# EAGLE design v2 demo (EAGLE 7.6.0)
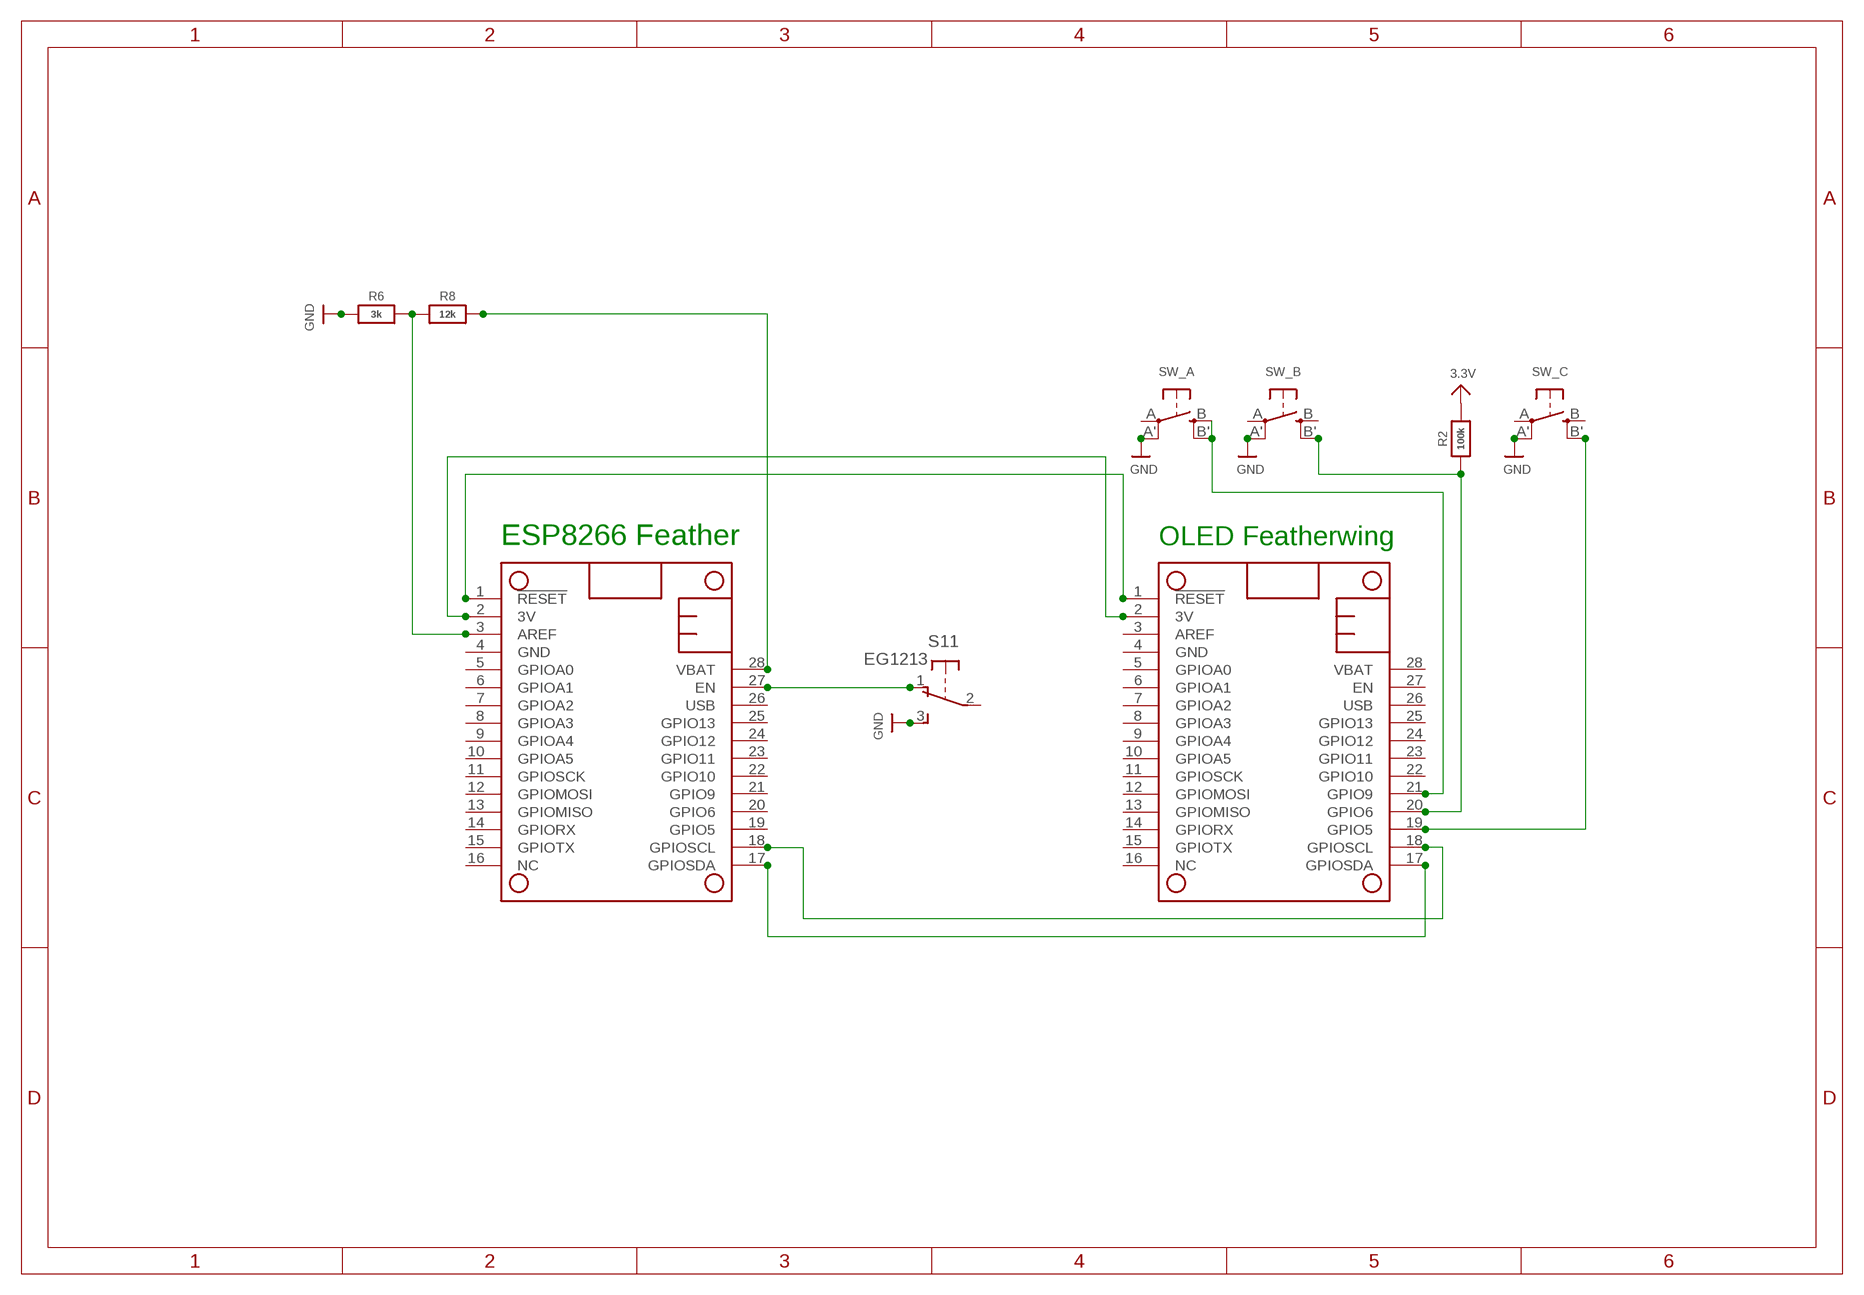
[diagram p0: schematic, sheet 1]

## Parts
MS1  FEATHERWING  [FEATHERWING]
MS2  FEATHERWING_NODIM  [FEATHERWING_DIM]
R2  100k  MICROBUILDER_RESISTOR0603MINI  [MICROBUILDER_0603-MINI]
R6  3k  MICROBUILDER_RESISTOR0603MINI  [MICROBUILDER_0603-MINI]
R8  12k  MICROBUILDER_RESISTOR0603MINI  [MICROBUILDER_0603-MINI]
S1  EG1213  [EG1213]
SW_A  MICROBUILDER_SWITCH_TACT_SMTKMT0  [MICROBUILDER_BTN_KMT0]
SW_B  MICROBUILDER_SWITCH_TACT_SMTKMT0  [MICROBUILDER_BTN_KMT0]
SW_C  MICROBUILDER_SWITCH_TACT_SMTKMT0  [MICROBUILDER_BTN_KMT0]

## Nets
3.3V: R2.2
3V: MS1.2(3V) MS2.2(3V)
GND: R6.1 S1.3(1:S) SW_A.A'(P1) SW_B.A'(P1) SW_C.A'(P1)
N$26: MS2.21(GPIO9) SW_A.B'(S1) SW_A.B(S)
N$27: MS2.20(GPIO6) R2.1 SW_B.B'(S1)
N$28: MS1.18(GPIOSCL) MS2.18(GPIOSCL)
N$29: MS1.17(GPIOSDA) MS2.17(GPIOSDA)
N$30: MS1.1(!RESET) MS2.1(!RESET)
N$31: MS2.19(GPIO5) SW_C.B'(S1)
N$32: MS1.3(AREF) R6.2 R8.1
N$34: MS1.27(EN) S1.1(1:O)
VBAT: MS1.28(VBAT) R8.2
Unconnected: MS1.5(GPIOA0) MS1.6(GPIOA1) MS1.7(GPIOA2) MS1.8(GPIOA3) MS1.9(GPIOA4) MS1.10(GPIOA5) MS1.11(GPIOSCK) MS1.12(GPIOMOSI) MS1.13(GPIOMISO) MS1.14(GPIORX) MS1.15(GPIOTX) MS1.16(NC) MS1.19(GPIO5) MS1.20(GPIO6) MS1.21(GPIO9) MS1.22(GPIO10) MS1.23(GPIO11) MS1.24(GPIO12) MS1.25(GPIO13) MS1.26(USB) MS2.3(AREF) MS2.5(GPIOA0) MS2.6(GPIOA1) MS2.7(GPIOA2) MS2.8(GPIOA3) MS2.9(GPIOA4) MS2.10(GPIOA5) MS2.11(GPIOSCK) MS2.12(GPIOMOSI) MS2.13(GPIOMISO) MS2.14(GPIORX) MS2.15(GPIOTX) MS2.16(NC) MS2.22(GPIO10) MS2.23(GPIO11) MS2.24(GPIO12) MS2.25(GPIO13) MS2.26(USB) MS2.27(EN) MS2.28(VBAT) S1.2(1:P) S1.MT1(MT) S1.MT2(MT) SW_A.A(P) SW_B.A(P) SW_B.B(S) SW_C.A(P) SW_C.B(S)

## Notes on the sheet
- ESP8266 Feather | OLED Featherwing

## Power pins joined to a net without a drawn wire
GND: MS1.4(GND) MS2.4(GND)

## Library data of the parts
MS1 MS2 = adafruit:FEATHERWING
R2 R6 R8 = adafruit oled featherwing:MICROBUILDER_RESISTOR: Resistors For new designs, use the packages preceded by an '_' character since they are more reliable: The following footprints should be used on most boards: _0402 - Standard footprint for regular board layouts _0603 - Standard footprint for regular board layouts _0805 - Standard footprint for regular board layouts _1206 - Standard footprint for regular board layouts For extremely tight-pitch boards where space is at a premium, the following 'micro-pitch' footprints can be used (smaller pads, no silkscreen outline, etc.): _0402MP - Micro-pitch footprint for very dense/compact boards _0603MP - Micro-pitch footprint for very dense/compact boards _0805MP - Micro-pitch footprint for very dense/compact boards _1206MP - Micro-pitch footprint for very dense/compact boards
S1 = adafruit:EG1213: E-Switch right-angle slide SPDT Part #EG1213 http://www.ladyada.net/library/eagle
SW_A SW_B SW_C = adafruit oled featherwing:MICROBUILDER_SWITCH_TACT_SMT: SMT Tact Switches 6x6mm - Digikey: P12940SCT-ND KMR2 (4.6x2.8mm) - Digikey: 401-1426-1-ND EVQ-PQHB55 - Light Touch, 160GF (4.5x4.5mm) - Digikey: P8090SCT-ND KMT0 - KMT021 NGJ LHS (etc.) IP68/Waterproof - Digikey: CKN10289CT-ND

## Board
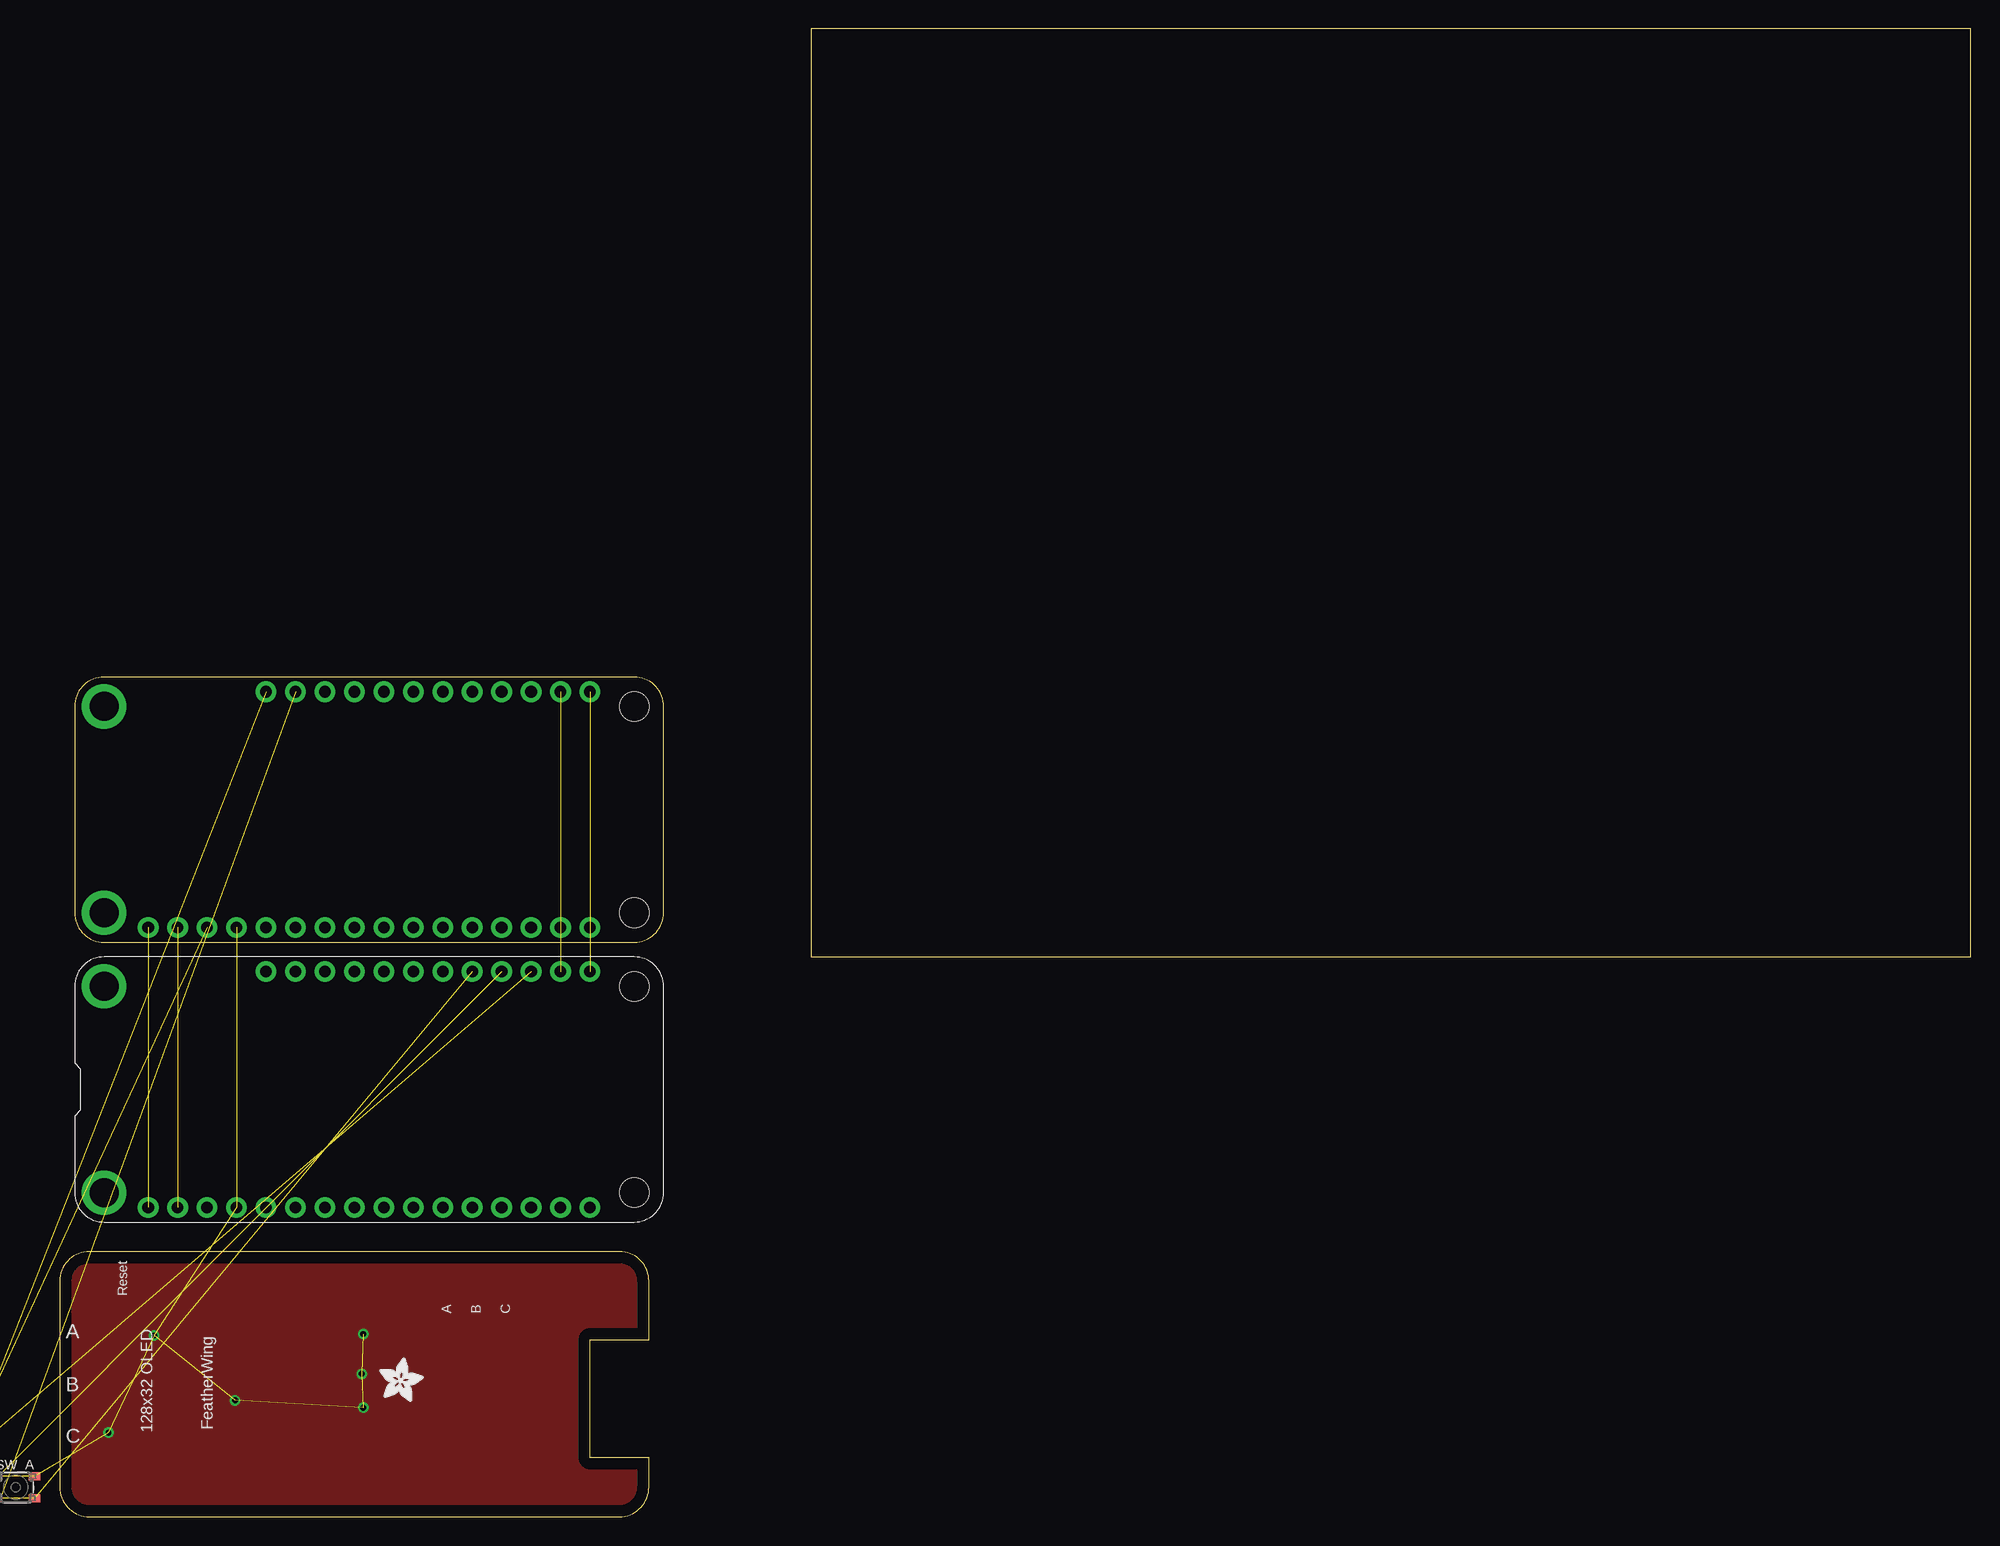
[diagram p1: board, top side]
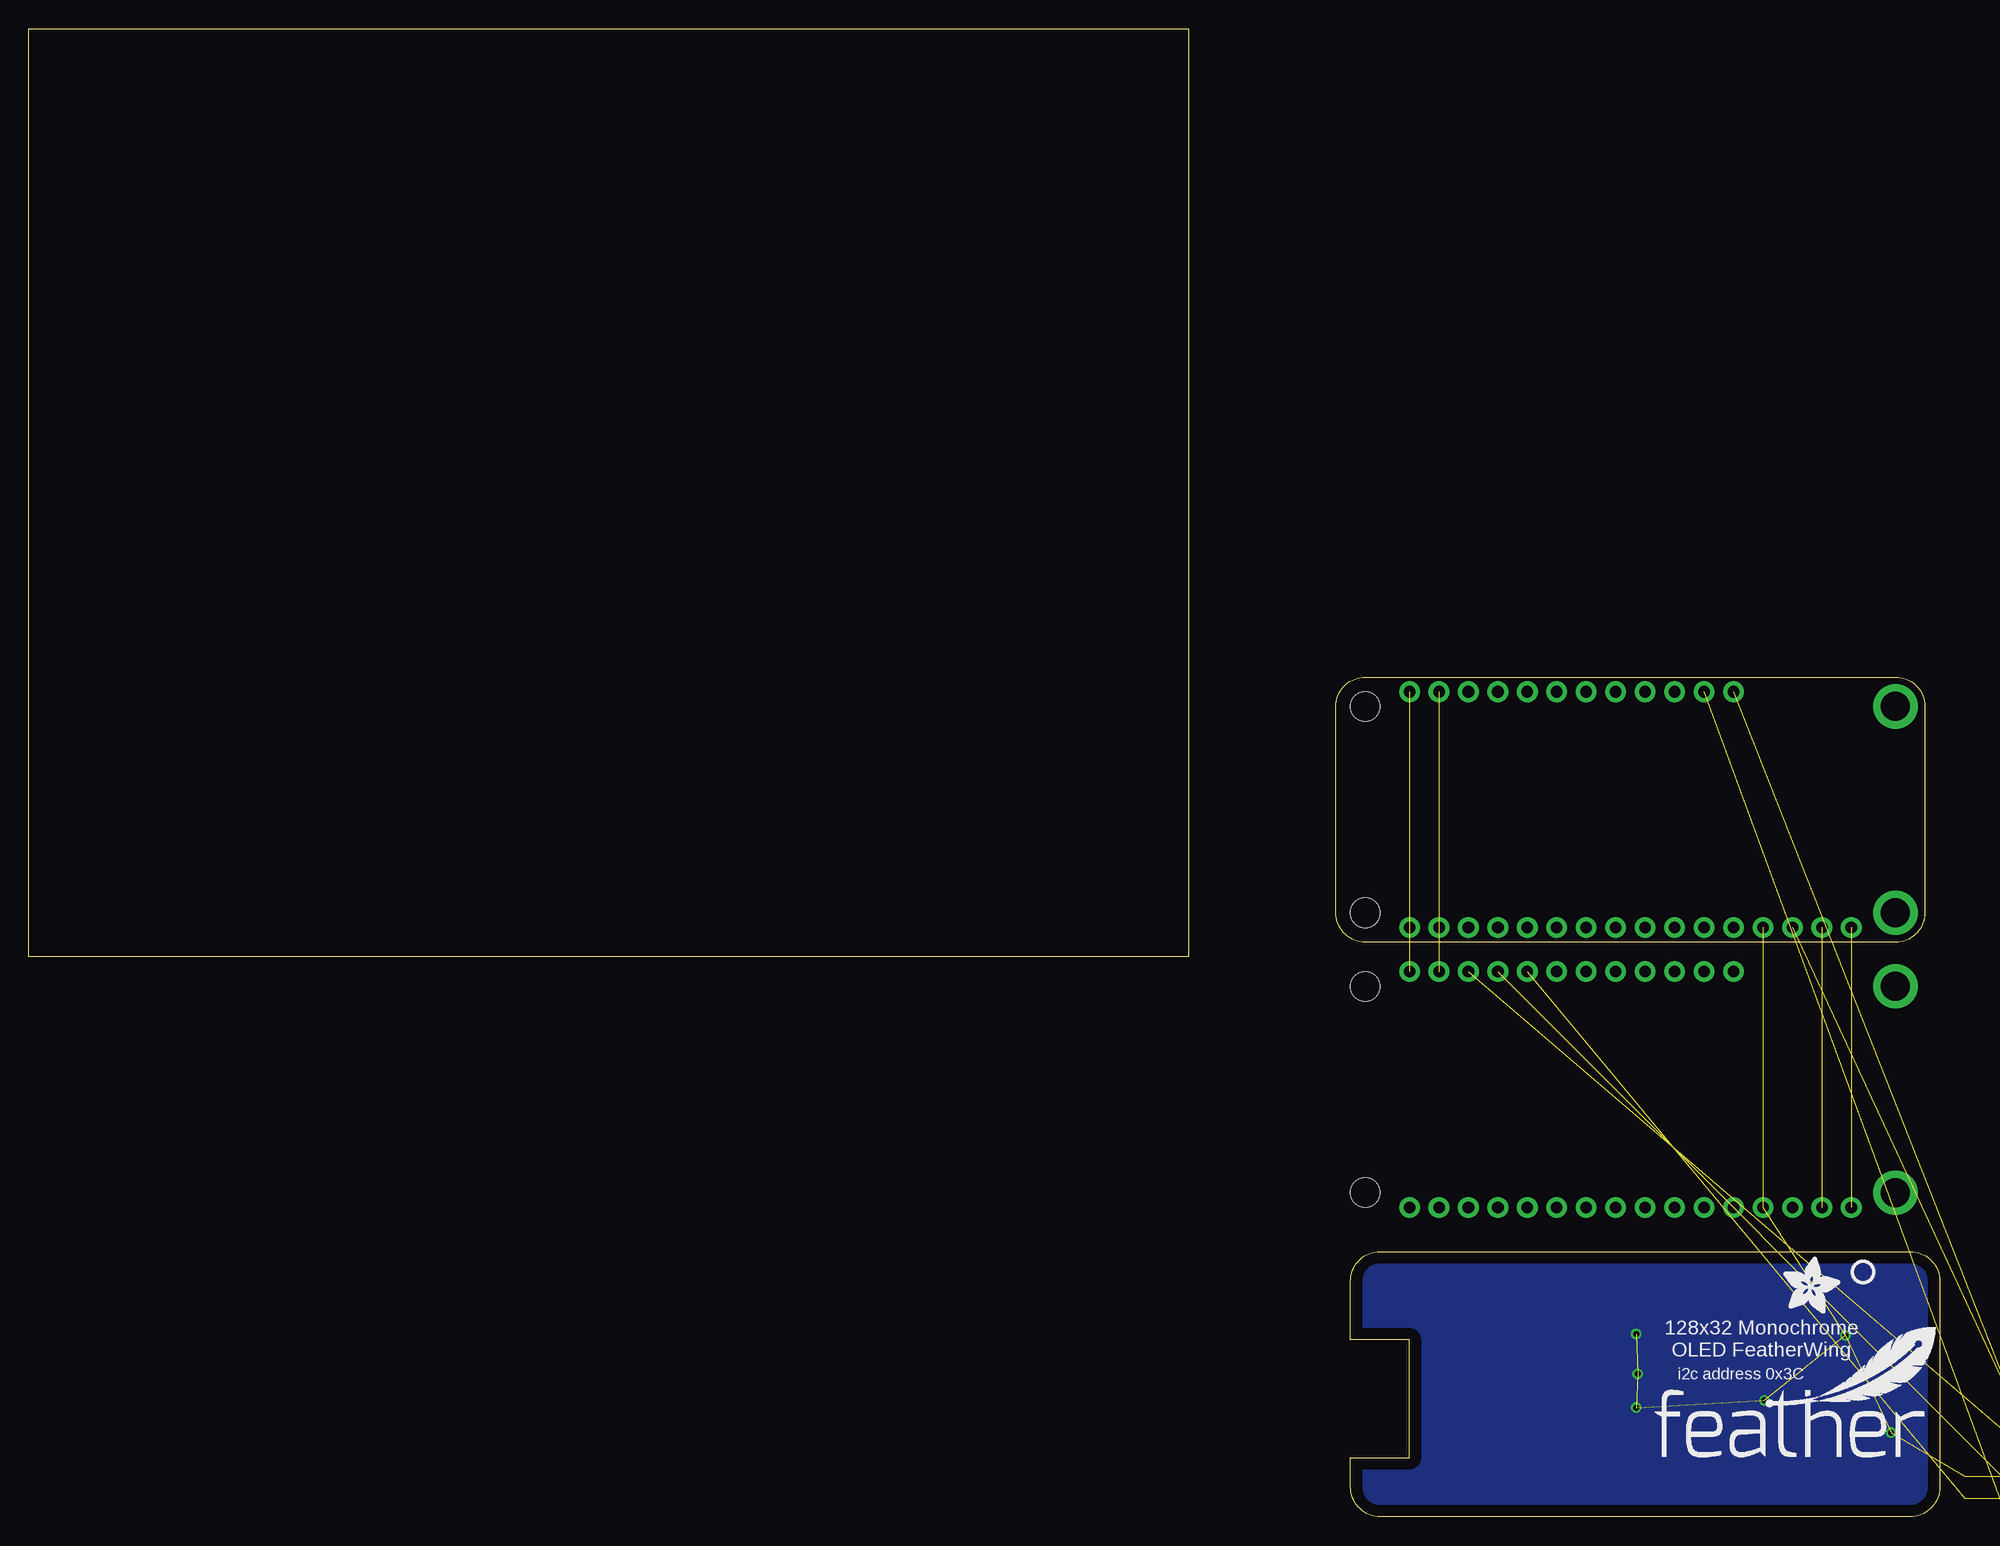
[diagram p2: board, bottom side, seen from below]

Size 164.77 x 128.26 mm. Coordinates in mm from the lower left corner, seen from the top.
Outline: 64.77,48.26 164.77,48.26 164.77,128.26 64.77,128.26 64.77,48.26
Outline: 50.8,15.24 50.8,20.32 arc90 48.26,22.86 2.54,22.86 arc90 0,20.32 0,2.54 arc90 2.54,0 48.26,0 arc90 50.8,2.54 50.8,5.08 45.72,5.08 45.72,15.24 50.8,15.24
Copper layers (1*16): Top 0.035mm / dielectric 1.5mm / Bottom 0.035mm
Design rules "default": minimum track width 10mil, minimum drill 24mil, track to track 8mil, track to pad 8mil, pad to pad 8mil, via to via 8mil, smd to smd 8mil, copper to edge 40mil, drill to drill 8mil, minimum pad ring 10mil, minimum via ring 8mil, stop-mask expansion 4mil, vias tented up to drill 0mil, thermal gap 10mil

### Footprints (pad centres in the part's own frame; a part is rotated, then mirrored left to right if it is on the bottom)
FEATHERWING = drill 1 pad 1.778: 1 6.35,1.27; 2 8.89,1.27; 3 11.43,1.27; 4 13.97,1.27; 5 16.51,1.27; 6 19.05,1.27; 7 21.59,1.27; 8 24.13,1.27; 9 26.67,1.27; 10 29.21,1.27; 11 31.75,1.27; 12 34.29,1.27; 13 36.83,1.27; 14 39.37,1.27; 15 41.91,1.27; 16 44.45,1.27; 17 44.45,21.59; 18 41.91,21.59; 19 39.37,21.59; 20 36.83,21.59; 21 34.29,21.59; 22 31.75,21.59; 23 29.21,21.59; 24 26.67,21.59; 25 24.13,21.59; 26 21.59,21.59; 27 19.05,21.59; 28 16.51,21.59 | drill 2.5 pad 3.81: P$1 2.54,20.32; P$2 2.54,2.54 | hole 2.54: 48.26,20.32; 48.26,2.54
FEATHERWING_DIM = drill 1 pad 1.778: 1 6.35,1.27; 2 8.89,1.27; 3 11.43,1.27; 4 13.97,1.27; 5 16.51,1.27; 6 19.05,1.27; 7 21.59,1.27; 8 24.13,1.27; 9 26.67,1.27; 10 29.21,1.27; 11 31.75,1.27; 12 34.29,1.27; 13 36.83,1.27; 14 39.37,1.27; 15 41.91,1.27; 16 44.45,1.27; 17 44.45,21.59; 18 41.91,21.59; 19 39.37,21.59; 20 36.83,21.59; 21 34.29,21.59; 22 31.75,21.59; 23 29.21,21.59; 24 26.67,21.59; 25 24.13,21.59; 26 21.59,21.59; 27 19.05,21.59; 28 16.51,21.59 | drill 2.5 pad 3.81: P$1 2.54,20.32; P$2 2.54,2.54 | hole 2.54: 48.26,20.32; 48.26,2.54
MICROBUILDER_0603-MINI = smd 0.9 x 0.9: 1 -0.75,0; 2 0.75,0
EG1213 = drill 0.7 pad 1.422: 1 -2,0; 2 0,0; 3 1.9,0 | drill 1.4 pad 2.54: MT1 -4.8,0; MT2 4.8,0
MICROBUILDER_BTN_KMT0 = smd 0.95 x 0.7: A -1.625,0.95; A' 1.625,0.95; B -1.625,-0.95; B' 1.625,-0.95

### Placement (x,y rotation side)
FRAME1  FRAME-LETTER  [CREATIVE_COMMONS]  5.08,-29.21 0 top  (outside the outline)
MS1  1.27,49.53 0 top
MS2  1.27,25.4 0 top
R2  -13.97,-2.54 0 top  (outside the outline)
R6  -13.97,-5.08 0 top  (outside the outline)
R8  -13.97,-7.62 0 top  (outside the outline)
S1  -8.89,-13.97 0 top  (outside the outline)
SW_A  -3.81,2.54 0 top
SW_B  -8.89,2.54 0 top  (outside the outline)
SW_C  -13.97,2.54 0 top  (outside the outline)
U$4  [FEATHERLOGO]  24.64,5.08 0 bottom
U$8  [ADAFRUIT_5MM]  13.46,17.53 0 bottom
U$14  [PCBFEAT-REV-040]  6.6,21.08 0 bottom
U$16  [ADAFRUIT_3.5MM]  27.56,9.91 0 top

### Tracks (layer width: path | path; a pad name or v marks a point on that pad's centre or on a via)
3V  (1 unrouted)
GND  (via drill 0.5)  (12 unrouted)
  other vias: 26.16,9.4 15.11,10.03 4.19,7.24 26.16,15.75 26.03,12.32 8.13,15.62
  pour Bottom: -0.25,23.11 -0.25,0 51.05,0 51.05,23.11
  pour Top: -0.25,22.86 -0.25,-0.25 51.05,0 51.05,23.11
N$26  (2 unrouted)
N$27  (2 unrouted)
N$28  (1 unrouted)
N$29  (1 unrouted)
N$30  (1 unrouted)
N$31  (1 unrouted)
N$32  (2 unrouted)
N$34  (1 unrouted)
VBAT  (1 unrouted)

### Text on the board
tPlace: Reset | A | B | C | A | B | 128x32 OLED | FeatherWing | C
bPlace: 128x32 Monochrome / OLED FeatherWing | i2c address 0x3C